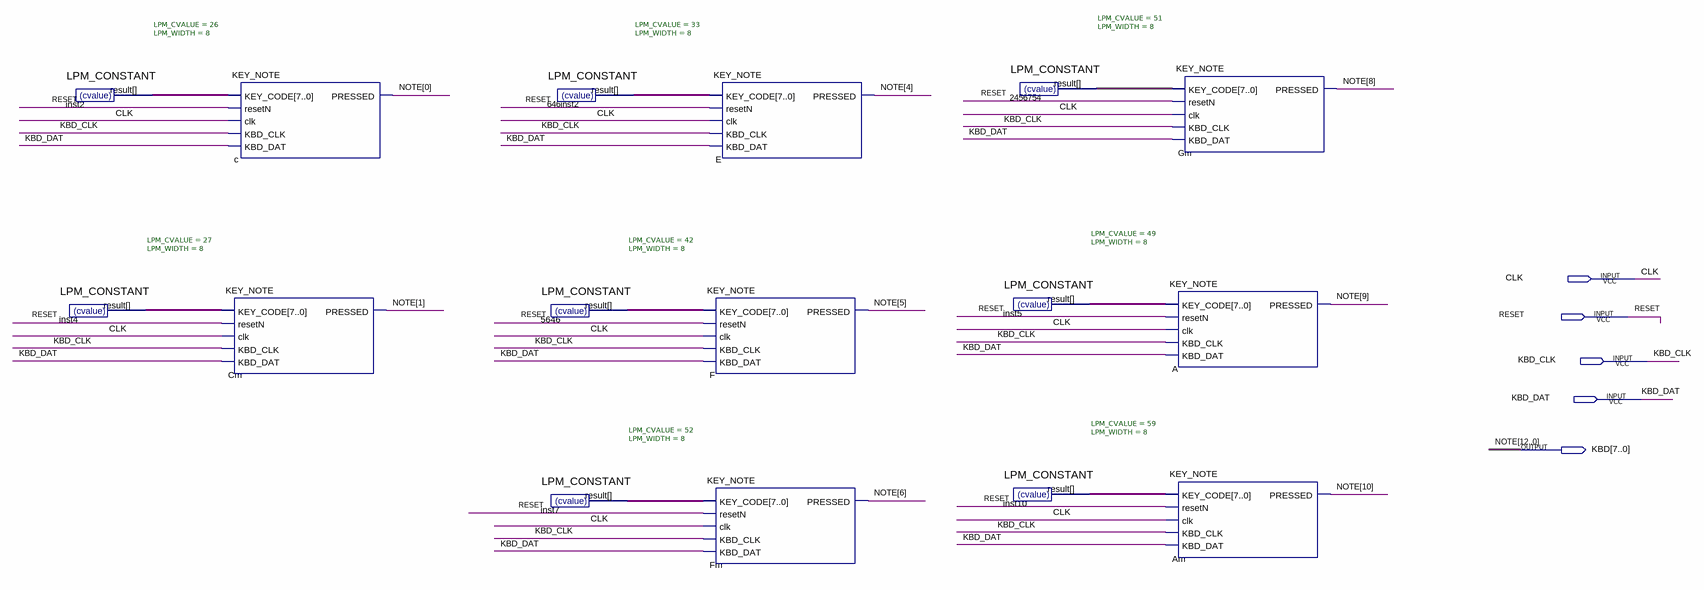
[diagram p0: schematic sheet]
// Quartus schematic KBD_MOD_LOOPER.bdf as structural Verilog: 16 symbols, 5 pins
module KBD_MOD_LOOPER (
  input  CLK,
  input  RESET,
  input  KBD_CLK,
  input  KBD_DAT,
  output [7:0] KBD
);

  wire [7:0] inst2_result, inst4_result, inst5_result, inst7_result, inst10_result, n646inst2_result,
       n5646_result, n2456754_result;
  wire [10:0] NOTE;

  LPM_CONSTANT #(.LPM_CVALUE(26), .LPM_WIDTH(8)) inst2 (.result(inst2_result));
  LPM_CONSTANT #(.LPM_CVALUE(27), .LPM_WIDTH(8)) inst4 (.result(inst4_result));
  KEY_NOTE c (
    .KEY_CODE(inst2_result), .resetN(RESET), .clk(CLK), .KBD_CLK(KBD_CLK), .KBD_DAT(KBD_DAT),
    .PRESSED(NOTE[0]));
  KEY_NOTE Cm (
    .KEY_CODE(inst4_result), .resetN(RESET), .clk(CLK), .KBD_CLK(KBD_CLK), .KBD_DAT(KBD_DAT),
    .PRESSED(NOTE[1]));
  LPM_CONSTANT #(.LPM_CVALUE(33), .LPM_WIDTH(8)) u_646inst2 (.result(n646inst2_result));
  LPM_CONSTANT #(.LPM_CVALUE(42), .LPM_WIDTH(8)) u_5646 (.result(n5646_result));
  LPM_CONSTANT #(.LPM_CVALUE(52), .LPM_WIDTH(8)) inst7 (.result(inst7_result));
  KEY_NOTE E (
    .KEY_CODE(n646inst2_result), .resetN(RESET), .clk(CLK), .KBD_CLK(KBD_CLK), .KBD_DAT(KBD_DAT),
    .PRESSED(NOTE[4]));
  KEY_NOTE F (
    .KEY_CODE(n5646_result), .resetN(RESET), .clk(CLK), .KBD_CLK(KBD_CLK), .KBD_DAT(KBD_DAT),
    .PRESSED(NOTE[5]));
  KEY_NOTE Fm (
    .KEY_CODE(inst7_result), .resetN(RESET), .clk(CLK), .KBD_CLK(KBD_CLK), .KBD_DAT(KBD_DAT),
    .PRESSED(NOTE[6]));
  LPM_CONSTANT #(.LPM_CVALUE(49), .LPM_WIDTH(8)) inst5 (.result(inst5_result));
  LPM_CONSTANT #(.LPM_CVALUE(59), .LPM_WIDTH(8)) inst10 (.result(inst10_result));
  LPM_CONSTANT #(.LPM_CVALUE(51), .LPM_WIDTH(8)) u_2456754 (.result(n2456754_result));
  KEY_NOTE Gm (
    .KEY_CODE(n2456754_result), .resetN(RESET), .clk(CLK), .KBD_CLK(KBD_CLK), .KBD_DAT(KBD_DAT),
    .PRESSED(NOTE[8]));
  KEY_NOTE A (
    .KEY_CODE(inst5_result), .resetN(RESET), .clk(CLK), .KBD_CLK(KBD_CLK), .KBD_DAT(KBD_DAT),
    .PRESSED(NOTE[9]));
  KEY_NOTE Am (
    .KEY_CODE(inst10_result), .resetN(RESET), .clk(CLK), .KBD_CLK(KBD_CLK), .KBD_DAT(KBD_DAT),
    .PRESSED(NOTE[10]));
endmodule
